# Altium project USB2UART.PrjPcb
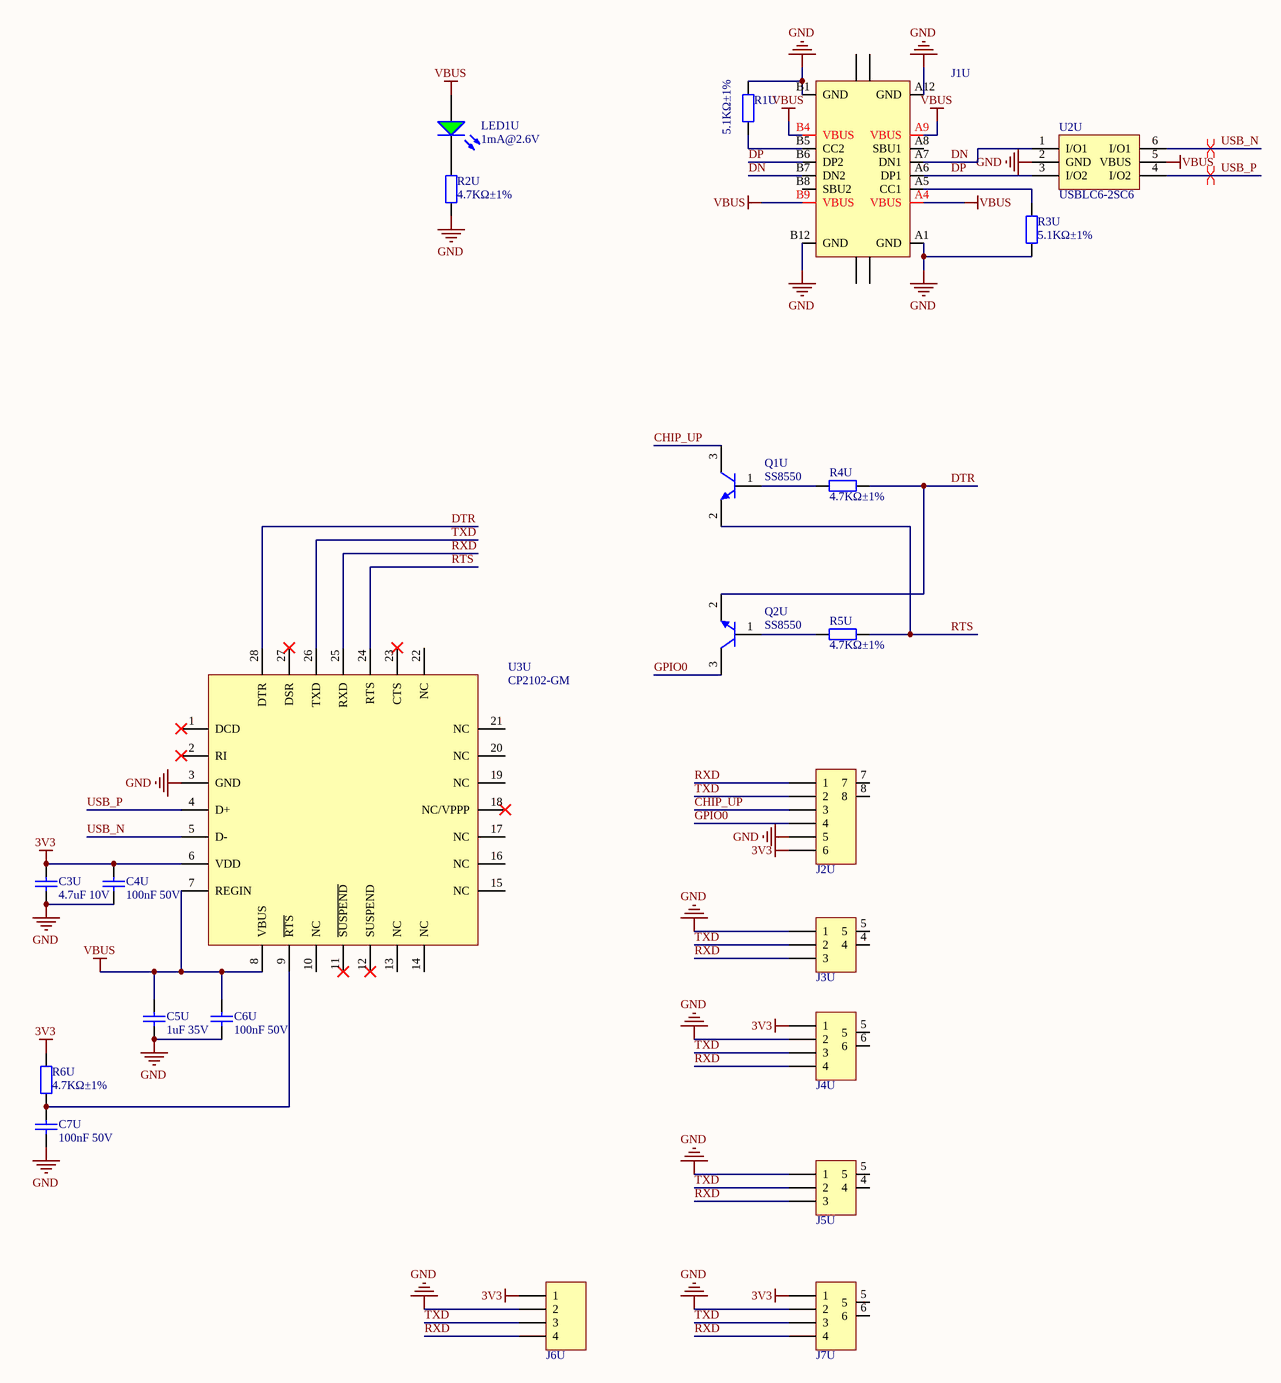
[diagram p0: USB2UART.SchDoc]
1 sheet, 23 parts. Net scope: global (net labels, ports and power ports of the same name join across sheets).
Board file: USB2UART.PcbDoc

## Sheet USB2UART.SchDoc
size A2

### Parts
C3U  value 4.7uF 10V  [c0402]  (hidden comment: 0402 4.7uF(475) ±10% 10V)
C4U  value 100nF 50V  [C0402]  (hidden comment: 0402 100nF (104) 10% 50V)
C5U  value 1uF 35V  [C0402]  (hidden comment: 0402 1uF（105）10% 35V)
C6U  value 100nF 50V  [C0402]  (hidden comment: 0402 100nF (104) 10% 50V)
C7U  value 100nF 50V  [C0402]  (hidden comment: 0402 100nF (104) 10% 50V)
J1U  TYPE-C-31-M-12  [TYPE-C-31-M-12]  (value not drawn)
J2U  SM06B-SRSS-TB(LF)(SN)  [SM06B-SRSS-TB(LF)(SN)]  (value not drawn)
J3U  SM03B-SRSS-TB(LF)(SN)  [SM03B-SRSS-TB(LF)(SN)]  (value not drawn)
J4U  SM04B-SRSS-TB(LF)(SN)  [SM04B-SRSS-TB(LF)(SN)]  (value not drawn)
J5U  A1257WR-S-3P  [SM03B-GHS-TB(LF)(SN)]  (value not drawn)
J6U  Header4x1 Male  [4x1]  (value not drawn)
J7U  A1257WR-S-4P  [SM04B-GHS-TB(LF)(SN)]  (value not drawn)
LED1U  value 1mA@2.6V  [led0603]  (hidden comment: LED_GREEN 0603)
Q1U  SS8550  [sot-23-3]
Q2U  SS8550  [sot-23-3]
R1U  value 5.1KΩ±1%  [r0402]  (hidden comment: 0402 5.1KΩ (5101) ±1%)
R2U  value 4.7KΩ±1%  [r0402]  (hidden comment: 0402 4.7KΩ (4701) ±1%)
R3U  value 5.1KΩ±1%  [r0402]  (hidden comment: 0402 5.1KΩ (5101) ±1%)
R4U  value 4.7KΩ±1%  [r0402]  (hidden comment: 0402 4.7KΩ (4701) ±1%)
R5U  value 4.7KΩ±1%  [r0402]  (hidden comment: 0402 4.7KΩ (4701) ±1%)
R6U  value 4.7KΩ±1%  [r0402]  (hidden comment: 0402 4.7KΩ (4701) ±1%)
U2U  USBLC6-2SC6  [sot-23-6]
U3U  CP2102-GM  [QFN28_EP]

### Nets
3V3: C3U.1 C4U.1 J2U.6 J4U.1 J6U.1 J7U.1 R6U.2 U3U.6(VDD)
GND: C3U.2 C4U.2 C5U.2 C6U.2 C7U.2 J1U.A1(GND) J1U.A12(GND) J1U.B1(GND) J1U.B12(GND) J2U.5 J3U.1 J4U.2 J5U.1 J6U.2 J7U.2 R1U.2 R2U.1 R3U.1 U2U.2(GND) U3U.3(GND)
VBUS: C5U.1 C6U.1 J1U.A4(VBUS) J1U.A9(VBUS) J1U.B4(VBUS) J1U.B9(VBUS) LED1U.1 U2U.5(VBUS) U3U.7(REGIN) U3U.8(VBUS)
CHIP_UP: J2U.3 Q1U.3(C)
DN: J1U.A7(DN1) J1U.B7(DN2) U2U.1(I/O1)
DP: J1U.A6(DP1) J1U.B6(DP2) U2U.3(I/O2)
DTR: Q2U.2(E) R4U.1 U3U.28(DTR)
GPIO0: J2U.4 Q2U.3(C)
RTS: Q1U.2(E) R5U.1 U3U.24(RTS)
RXD: J2U.1 J3U.3 J4U.4 J5U.3 J6U.4 J7U.4 U3U.25(RXD)
TXD: J2U.2 J3U.2 J4U.3 J5U.2 J6U.3 J7U.3 U3U.26(TXD)
USB_N: U2U.6(I/O1) U3U.5(D-)
USB_P: U2U.4(I/O2) U3U.4(D+)
NetC7U_1: C7U.1 R6U.1 U3U.9(~{RTS})
NetJ1U_A5: J1U.A5(CC1) R3U.2
NetJ1U_B5: J1U.B5(CC2) R1U.1
NetLED1U_2: LED1U.2 R2U.2
NetQ1U_1: Q1U.1(B) R4U.2
NetQ2U_1: Q2U.1(B) R5U.2

Not connected (* = marked no-connect by the designer): J1U A8(SBU1) B8(SBU2) M1(0) M2 M3 M4; J2U 7 8; J3U 4 5; J4U 5 6; J5U 4 5; J7U 5 6; U3U 1(DCD)* 2(RI)* 10(NC) 11(~{SUSPEND})* 12(SUSPEND)* 13(NC) 14(NC) 15(NC) 16(NC) 17(NC) 18(NC/VPPP)* 19(NC) 20(NC) 21(NC) 22(NC) 23(CTS)* 27(DSR)*

### Layout directives
differential pair: USB_N, USB_P

### Library data of the parts
C3U = 0402 4.7uF(475) ±10% 10V: Type: Capacitor; Part Number: 0402 4.7uF(475) ±10% 10V; Component Type: C; Package: 0402; Supplier 1: SAMSUNG(三星); Supplier 1 Part Number: CL05A475KP5NRNC
C4U C6U C7U = 0402 100nF (104) 10% 50V: Type: Capacitor; Part Number: 0402 100nF (104) 10% 50V; Component Type: C; Package: 0402; Supplier 1: YAGEO(国巨); Supplier 1 Part Number: CC0402KRX5R9BB104
C5U = 0402 1uF（105）10% 35V: Type: Capacitor; Part Number: 0402 1uF（105）10% 35V; Component Type: C; Package: 0402; Supplier 1: kyocera 京瓷; Supplier 1 Part Number: CM05X5R105K35AH
J1U = TYPE-C-31-M-12: Type-C 16pin Connector; Manufacturer: 韩荣; Part Number: TYPE-C-31-M-12; Type: Connector; Component Type: Z; Value: TYPE-C-31-M-12; Package: TYPE-C-31-M-12; Supplier 1: 韩荣; Supplier 1 Part Number: TYPE-C-31-M-12
J2U = SM06B-SRSS-TB(LF)(SN): 1.0mm pitch/Disconnectable Insulation displacement connectors; Manufacturer: JST; Part Number: SM06B-SRSS-TB(LF)(SN); Type: Connector; Component Type: A; Value: SM06B-SRSS-TB(LF)(SN); Package: Header6; Supplier 1: JST; Supplier 1 Part Number: SM06B-SRSS-TB(LF)(SN)
J3U = SM03B-SRSS-TB(LF)(SN): 1.0mm pitch/Disconnectable Insulation displacement connectors; Manufacturer: JST; Part Number: SM03B-SRSS-TB(LF)(SN); Type: Connector; Component Type: A; Value: SM03B-SRSS-TB(LF)(SN); Package: Header3; Supplier 1: JST; Supplier 1 Part Number: SM03B-SRSS-TB(LF)(SN)
J4U = SM04B-SRSS-TB(LF)(SN): 1.0mm pitch/Disconnectable Insulation displacement connectors; Manufacturer: JST; Part Number: SM04B-SRSS-TB(LF)(SN); Type: Connector; Component Type: A; Value: SM04B-SRSS-TB(LF)(SN); Package: Header4; Supplier 1: JST; Supplier 1 Part Number: SM04B-SRSS-TB(LF)(SN)
J5U = A1257WR-S-3P: Manufacturer: CJT; Part Number: A1257WR-S-3P; Type: Connector; Component Type: A; Value: A1257WR-S-3P; Package: A1257WR-S-3P; Supplier 1: CJT; Supplier 1 Part Number: A1257WR-S-3P
J7U = A1257WR-S-4P: Manufacturer: CJT; Part Number: A1257WR-S-4P; Type: Connector; Component Type: A; Value: A1257WR-S-4P; Package: A1257WR-S-4P; Supplier 1: CJT; Supplier 1 Part Number: A1257WR-S-4P
LED1U = LED_GREEN 0603: Type: LED; Part Number: LED_GREEN 0603; Component Type: C; Package: 0603; Supplier 1: 国星光电; Supplier 1 Part Number: NCD0603G2
Q1U Q2U = SS8550: 25V NPN; Manufacturer: JCST; Type: IC; Part Number: SS8550; Value: SS8550; Component Type: B; Package: sot-23-3; Supplier 1: JCST; Supplier 1 Part Number: SS8550
U2U = USBLC6-2SC6: Very low capacitance ESD protection; Manufacturer: ST; Part Number: USBLC6-2SC6; Value: USBLC6-2SC6; Type: IC; Component Type: A; Package: sot-23-6; Supplier 1: ST; Supplier 1 Part Number: USBLC6-2SC6
U3U = CP2102-GM: Single-Chip USB to UART Data Transfer; Manufacturer: Silicon Labs; Part Number: CP2102-GM; Value: CP2102-GM; Type: IC; Component Type: Z; Package: QFN28; Supplier 1: Silicon Labs; Supplier 1 Part Number: CP2102-GM
J6U = Header4x1 Male: Part Number: Header4x1 Male; Type: Connector; Component Type: Z; Value: Header4x1 Male; Package: Header4x1
R1U R3U = 0402 5.1KΩ (5101) ±1%: Part Number: 0402 5.1KΩ (5101) ±1%; Type: Resistor; Component Type: C; Package: 0402; Supplier 1: YAGEO(国巨); Supplier 1 Part Number: RC0402FR-075K1L
R2U R4U R5U R6U = 0402 4.7KΩ (4701) ±1%: Part Number: 0402 4.7KΩ (4701) ±1%; Type: Resistor; Component Type: C; Package: 0402; Supplier 1: YAGEO(国巨); Supplier 1 Part Number: RC0402FR-074K7L

## Assembly variants
Default: not fitted H1 H2 H3 H4 R1 R2